# Altium project PMR_for_R124_test.PrjPcb (part 1 of 2)
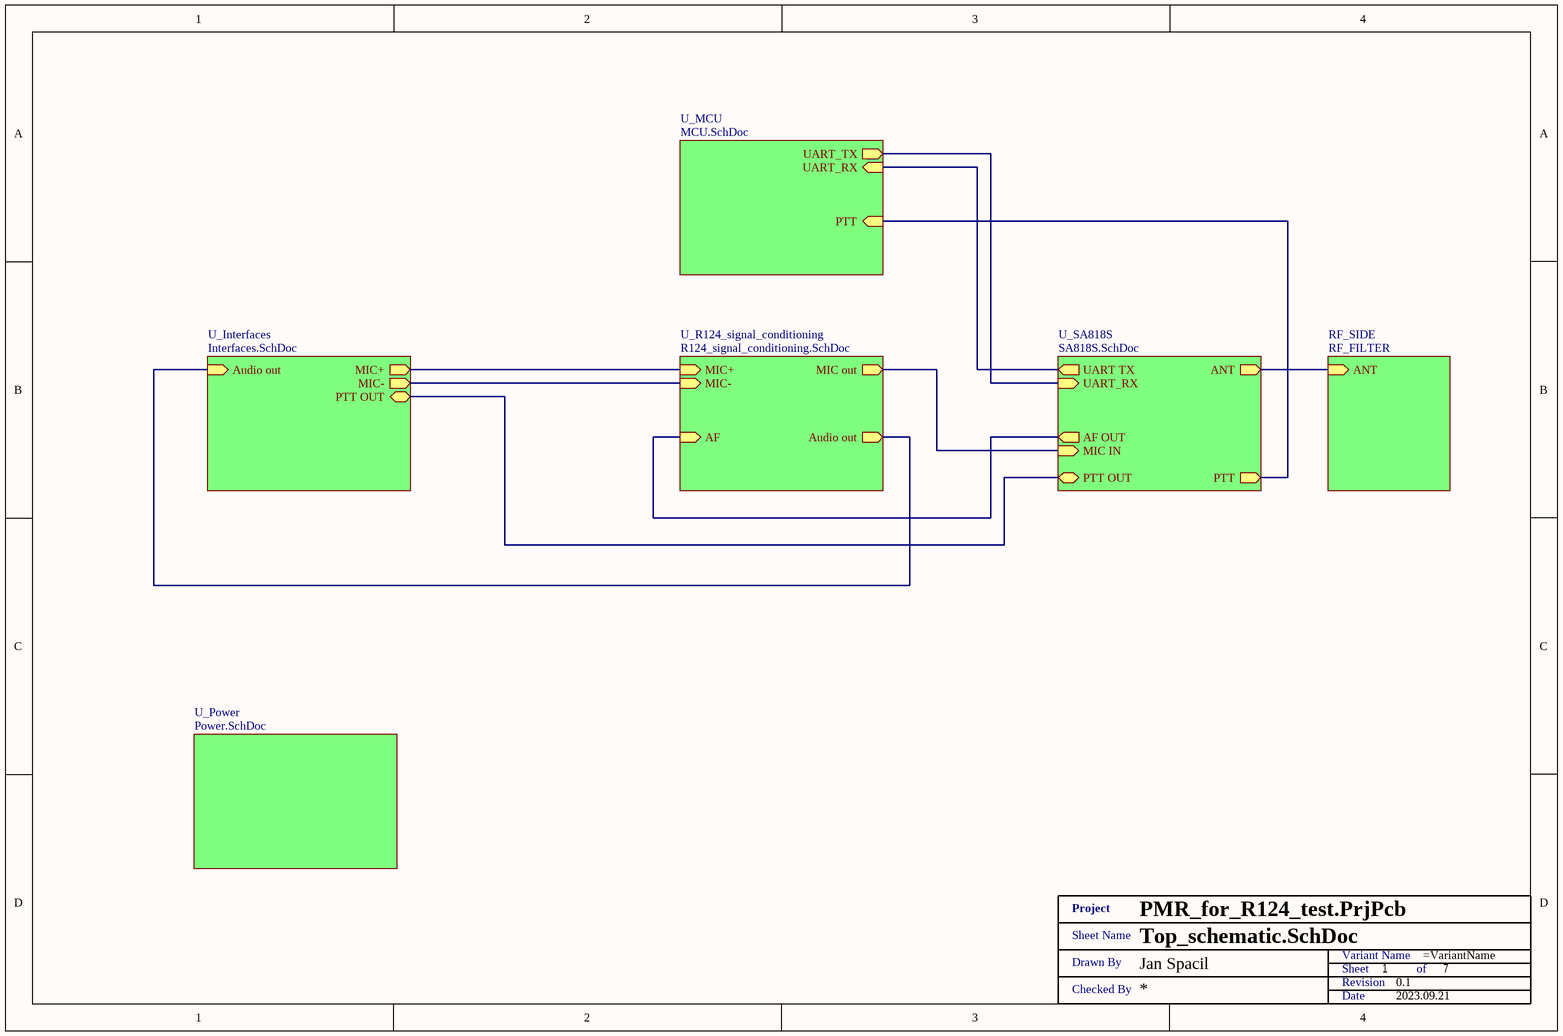
[diagram p0: Top_schematic.SchDoc]
Date: 2023.09.21; DrawnBy: Jan Spacil; Revision: 0.1
5 sheets, 116 parts. Net scope: hierarchical (ports join the sheet entries above them; power ports are global).
Board file: PMR_for_R124_test.PcbDoc
Sheets:
  Top_schematic.SchDoc
    U_R124_signal_conditioning = R124_signal_conditioning.SchDoc
    U_SA818S = SA818S.SchDoc
    U_MCU = MCU.SchDoc
    U_Interfaces = Interfaces.SchDoc

## Sheet Top_schematic.SchDoc
size A4; DocumentNumber: 1; SheetNumber: 1; SheetTotal: 7

### Parts
(Parts that share a designator on the sheet are numbered #1, #2 ... from top to bottom, then left to right.)
XX?#1  Title 1  (value not drawn)  (graphical)

### Sub-sheets
RF_SIDE = RF_FILTER (file not in this document): ANT (in)
U_Interfaces = Interfaces.SchDoc: MIC+ (out), MIC- (out), Audio out (in), PTT OUT (bidir)
U_MCU = MCU.SchDoc: UART_TX (out), UART_RX (in), PTT (in)
U_Power = Power.SchDoc (file not in this document): no entries
U_R124_signal_conditioning = R124_signal_conditioning.SchDoc: MIC+ (in), MIC- (in), MIC out (out), AF (in), Audio out (out)
U_SA818S = SA818S.SchDoc: ANT (out), UART_RX (in), UART TX (out), AF OUT (out), MIC IN (in), PTT OUT (bidir), PTT (out)

### Nets
AF OUT: sheet U_R124_signal_conditioning/AF, sheet U_SA818S/AF OUT
ANT: sheet U_SA818S/ANT, sheet RF_SIDE/ANT
AUDIO OUT: sheet U_R124_signal_conditioning/Audio out, sheet U_Interfaces/Audio out
MIC OUT: sheet U_R124_signal_conditioning/MIC out, sheet U_SA818S/MIC IN
MIC+: sheet U_R124_signal_conditioning/MIC+, sheet U_Interfaces/MIC+
MIC-: sheet U_R124_signal_conditioning/MIC-, sheet U_Interfaces/MIC-
PTT: sheet U_SA818S/PTT, sheet U_MCU/PTT
PTT OUT: sheet U_SA818S/PTT OUT, sheet U_Interfaces/PTT OUT
UART_RX: sheet U_SA818S/UART TX, sheet U_MCU/UART_RX
UART_TX: sheet U_SA818S/UART_RX, sheet U_MCU/UART_TX

### Notes on the sheet
- (in symbol Title 1) Project; Sheet Name; Variant Name; Drawn By; Sheet; of; Revision; Checked By; Date

## Sheet R124_signal_conditioning.SchDoc
size A3; DocumentNumber: 2; SheetNumber: 2; SheetTotal: 7
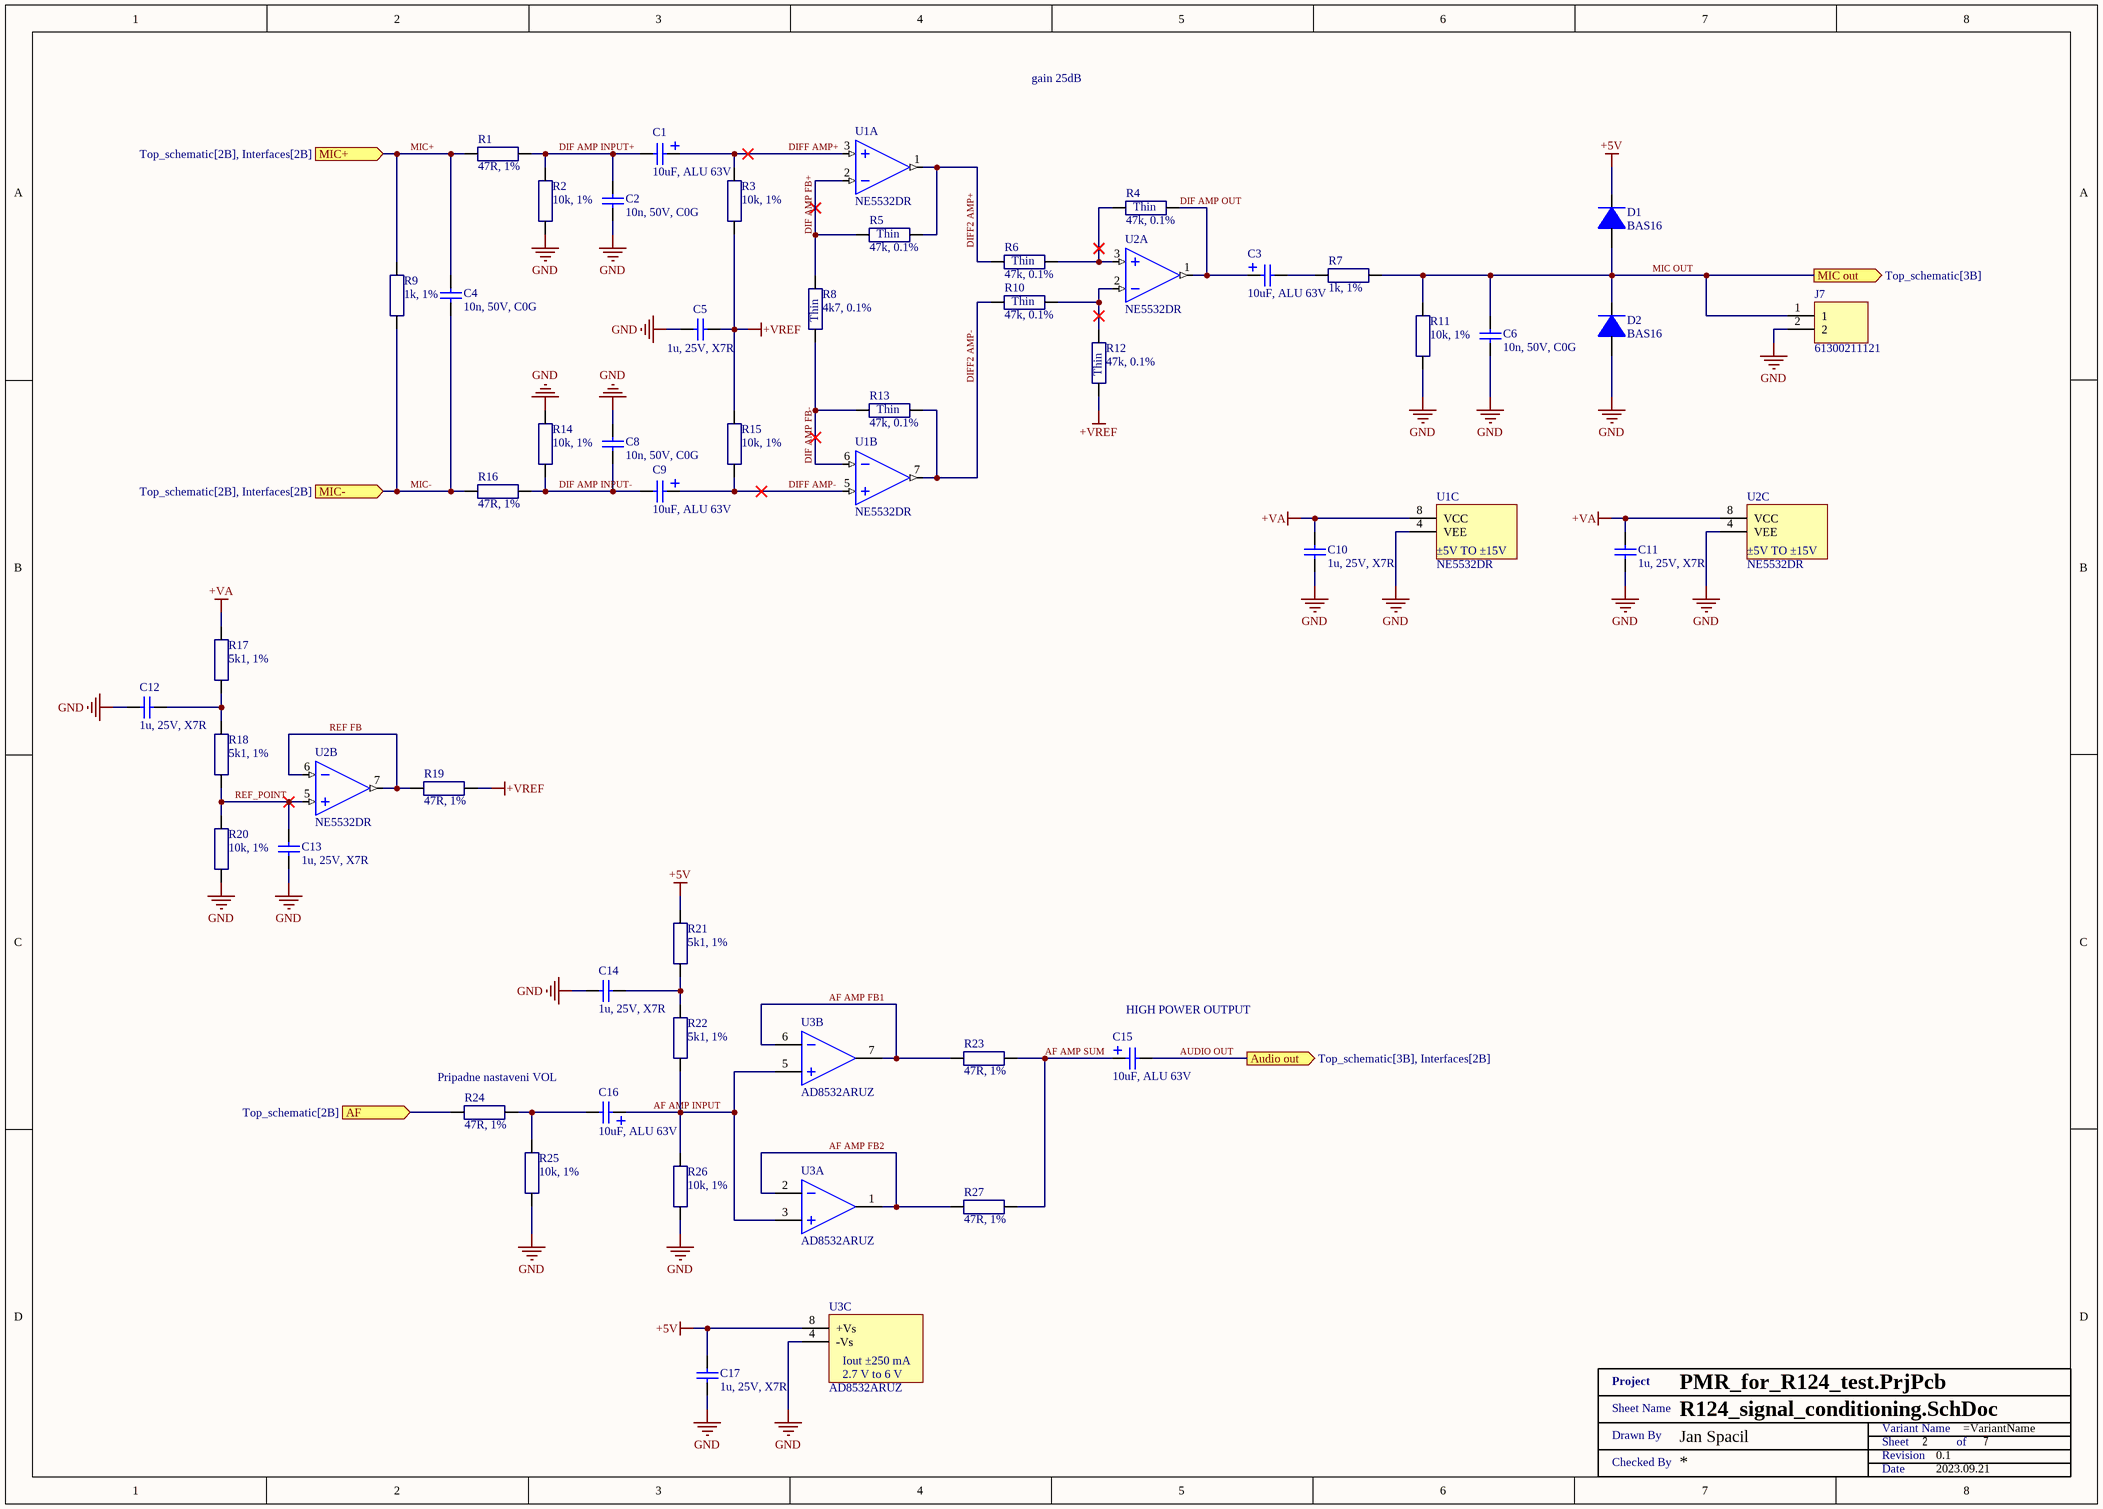
[diagram p1: R124_signal_conditioning.SchDoc]

### Parts
(Parts that share a designator on the sheet are numbered #1, #2 ... from top to bottom, then left to right.)
C1  10uF, ALU 63V  [WCAP-ATLI_5x11x2]
C2  10n, 50V, C0G  [SMD0603]
C3  10uF, ALU 63V  [WCAP-ATLI_5x11x2]
C4  10n, 50V, C0G  [SMD0603]
C5  1u, 25V, X7R  [SMD0603]
C6  10n, 50V, C0G  [SMD0603]
C8  10n, 50V, C0G  [SMD0603]
C9  10uF, ALU 63V  [WCAP-ATLI_5x11x2]
C10  1u, 25V, X7R  [SMD0603]
C11  1u, 25V, X7R  [SMD0603]
C12  1u, 25V, X7R  [SMD0603]
C13  1u, 25V, X7R  [SMD0603]
C14  1u, 25V, X7R  [SMD0603]
C15  10uF, ALU 63V  [WCAP-ATLI_5x11x2]
C16  10uF, ALU 63V  [WCAP-ATLI_5x11x2]
C17  1u, 25V, X7R  [SMD0603]
D1  BAS16  [SOT23 (TO-236AB)]
D2  BAS16  [SOT23 (TO-236AB)]
J7  61300211121  [Header 2 2.54mm]
R1  47R, 1%  [SMD0603 - R]
R2  10k, 1%  [SMD0603 - R]
R3  10k, 1%  [SMD0603 - R]
R4  47k, 0.1%  [SMD0603 - R]
R5  47k, 0.1%  [SMD0603 - R]
R6  47k, 0.1%  [SMD0603 - R]
R7  1k, 1%  [SMD0603 - R]
R8  4k7, 0.1%  [SMD0603 - R]
R9  1k, 1%  [SMD0603 - R]
R10  47k, 0.1%  [SMD0603 - R]
R11  10k, 1%  [SMD0603 - R]
R12  47k, 0.1%  [SMD0603 - R]
R13  47k, 0.1%  [SMD0603 - R]
R14  10k, 1%  [SMD0603 - R]
R15  10k, 1%  [SMD0603 - R]
R16  47R, 1%  [SMD0603 - R]
R17  5k1, 1%  [SMD0603 - R]
R18  5k1, 1%  [SMD0603 - R]
R19  47R, 1%  [SMD0603 - R]
R20  10k, 1%  [SMD0603 - R]
R21  5k1, 1%  [SMD0603 - R]
R22  5k1, 1%  [SMD0603 - R]
R23  47R, 1%  [SMD0603 - R]
R24  47R, 1%  [SMD0603 - R]
R25  10k, 1%  [SMD0603 - R]
R26  10k, 1%  [SMD0603 - R]
R27  47R, 1%  [SMD0603 - R]
U1  NE5532DR  [SOIC08]  (parts A,B,C of 3)
U2  NE5532DR  [SOIC08]  (parts A,B,C of 3)
U3  AD8532ARUZ  [TSSOP08]  (parts A,B,C of 3)
XX?#2  Title 1  (value not drawn)  (graphical)

### Ports
AF (in, see Top_schematic[2B]), Audio out (out, see Top_schematic[3B], Interfaces[2B]), MIC out (out, see Top_schematic[3B]), MIC+ (in, see Top_schematic[2B], Interfaces[2B]), MIC- (in, see Top_schematic[2B], Interfaces[2B])

### Nets
+5V: C17.2 D1.3(C) R21.2 U3.8(+Vs)
+VA: C10.2 C11.2 R17.2 U1.8(VCC) U2.8(VCC)
+VREF: C5.1 R3.1 R12.1 R15.1 R19.2
GND: C2.1 C5.2 C6.1 C8.2 C10.1 C11.1 C12.1 C13.1 C14.1 C17.1 D2.1(A) J7.2 R2.1 R11.1 R14.1 R20.2 R25.2 R26.2 U1.4(VEE) U2.4(VEE) U3.4(-Vs)
AF AMP FB1: R23.1 U3.6(-INb) U3.7(OUTb)
AF AMP FB2: R27.1 U3.1(OUTa) U3.2(-INa)
AF AMP INPUT: C16.1 R22.1 R26.1 U3.3(+INa) U3.5(+INb)
AF AMP SUM: C15.1 R23.2 R27.2
AF OUT: R24.1 ; port AF
AUDIO OUT: C15.2 ; port Audio out
DIF AMP FB+: R5.1 R8.2 U1.2(-IN_A)
DIF AMP FB-: R8.1 R13.1 U1.6(-IN_B)
DIF AMP INPUT+: C1.2 C2.2 R1.2 R2.2
DIF AMP INPUT-: C8.1 C9.2 R14.2 R16.2
DIF AMP OUT: C3.1 R4.2 U2.1(OUT_A)
DIFF2 AMP+: R5.2 R6.1 U1.1(OUT_A)
DIFF2 AMP-: R10.1 R13.2 U1.7(OUT_B)
DIFF AMP+: C1.1 R3.2 U1.3(+IN_A)
DIFF AMP-: C9.1 R15.2 U1.5(+IN_B)
MIC OUT: C6.2 D1.1(A) D2.3(C) J7.1 R7.1 R11.2 ; port MIC out
MIC+: C4.2 R1.1 R9.2 ; port MIC+
MIC-: C4.1 R9.1 R16.1 ; port MIC-
REF FB: R19.1 U2.6(-IN_B) U2.7(OUT_B)
REF_POINT: C13.2 R18.1 R20.1 U2.5(+IN_B)
NetC3_2: C3.2 R7.2
NetC12_2: C12.2 R17.1 R18.2
NetC14_2: C14.2 R21.1 R22.2
NetC16_2: C16.2 R24.2 R25.1
NetR4_1: R4.1 R6.2 U2.3(+IN_A)
NetR10_2: R10.2 R12.2 U2.2(-IN_A)

### Notes on the sheet
- gain 25dB
- (near C15) HIGH POWER OUTPUT
- Pripadne nastaveni VOL
- (in symbol AD8532ARUZ-REEL, part C) Iout ±250 mA; 2.7 V to 6 V
- (in symbol NE5532DR, part C) ±5V TO ±15V
- (in symbol RT0603BRB074K7L) Thin
- (in symbol RT0603BRD0747KL) Thin
- (in symbol Title 1) Project; Sheet Name; Variant Name; Drawn By; Sheet; of; Revision; Checked By; Date

### Library data of the parts
C1 C3 C9 C15 C16 = 860080772001: WURTH ELEKTRONIK - 860080772001 - CAP, ALU ELEC, 10UF, 63V, RADIAL; Ripple Current: 135mA @ 100kHz; Capacitance: 10u; Manufacturer: WURTH ELEKTRONIK; Manufacturer Part Number: 860080772001; RoHS: YES; Stock 1: 553; Pricing 1: 1=0.0957, 3=0.091, 5=0.0863, 10=0.0825, 20=0.0786, 50=0.0692, 250=0.0647, 500=0.0564 (GBP); ComponentLink1URL: http://www.farnell.com/datasheets/1879798.pdf; ComponentLink1Description: http://www.farnell.com/datasheets/1879798.pdf; Voltage Rating: 63V; Stock 3: 2136; Pricing 3: 1=0.62, 50=0.335, 100=0.289, 250=0.259, 500=0.235, 1500=0.202, 7500=0.182, 15000=0.178 (GBP); ComponentLink2URL: http://www.farnell.com/datasheets/2065186.pdf; ComponentLink2Description: http://www.farnell.com/datasheets/2065186.pdf; Supplier 1: Mouser; Supplier Part Number 1: 710-860080772001; Supplier 2: Farnell; Supplier Part Number 2: 2465955; Supplier 3: Digi-Key; Supplier Part Number 3: 732-9121-1-ND
C2 C4 C6 C8 = GRM1885C1H103JA01D: Multilayer Ceramic Capacitors MLCC - SMD/SMT 0603 50VDC 10000pF 5% C0G; Manufacturer: Murata Electronics; Type: Chip Multilayer Ceramic Capacitor for General Purpose; Capacitance - nF: 10 nF; Class: Class 1; CNHTS: 8532241000; Dielectric: C0G (NP0); TARIC: 8532240000; Supplier 1: Mouser; Supplier Part Number 1: 81-GRM1885C1H103JA1D; Manufacturer Part Number: GRM1885C1H103JA01D; RoHS: RoHS Compliant; Category: Multilayer Ceramic Capacitors MLCC - SMD/SMT; Stock 1: 217291; Pricing 1: 1=0.183, 10=0.129, 100=0.065, 500=0.045, 1000=0.039, 4000=0.030, 8000=0.027, 24000=0.025 (EUR); Capacitance: 10n; Height: 0.8 mm; Length: 1.6 mm; Package / Case: 0603 (1608 metric); Packaging: Cut Tape; Product: General Type MLCCs; Series: GRM; Termination Style: SMD/SMT; Tolerance: 5 %; Voltage Rating DC: 50 VDC; Width: 0.8 mm; Brand: Murata Electronics; Capacitance - pF: 10000 pF; Case Code - in: 0603; Case Code - mm: 1608; HTS Code: 8532240020; Maximum Operating Temperature: + 125 C; Minimum Operating Temperature: - 55 C; Product Type: Ceramic Capacitors; Standard Pack Qty: 4000; Subcategory: Capacitors; Termination: Standard; RoHS - Mouser: Y; Minimum Order Quantity: 1; Reeling: True; ComponentLink1URL: http://www.mouser.com/datasheet/2/281/murata_03052018_GRM_Series_1-1310166.pdf; ComponentLink1Description: http://www.mouser.com/datasheet/2/281/murata_03052018_GRM_Series_1-1310166.pdf; Supplier 2: Farnell; Supplier Part Number 2: 2456107
C5 C10-C14 C17 = CGA3E1X7R1E105K080AC: CAP CER 1UF 25V X7R 0603; Manufacturer: TDK Corporation; Tolerance: ±10%; Manufacturer Part Number: CGA3E1X7R1E105K080AC; RoHS: RoHS Compliant; Category: Capacitors; Stock 1: 109509; Pricing 1: 1=0.2, 10=0.135, 100=0.0686, 500=0.04696, 1000=0.04154 (USD); Packaging: Cut Tape (CT); Part Status: Active; Voltage - Rated: 25V; Temperature Coefficient: X7R; Operating Temperature: -55°C ~ 125°C; Features: -; Ratings: AEC-Q200; Applications: Automotive; Failure Rate: -; Mounting Type: Surface Mount, MLCC; Package / Case: 0603 (1608 Metric); Size / Dimension: 0.063" L x 0.032" W (1.60mm x 0.80mm); Height - Seated (Max): -; Thickness (Max): 0.035" (0.90mm); Lead Spacing: -; Lead Style: -; ComponentLink1URL: https://product.tdk.com/info/en/catalog/datasheets/mlcc_automotive_general_en.pdf; ComponentLink1Description: https://product.tdk.com/info/en/catalog/datasheets/mlcc_automotive_general_en.pdf; Capacitance: 1u; Supplier 1: Mouser; Supplier Part Number 1: 810-CGA3E1X7R1E105K; Supplier 2: Farnell; Supplier Part Number 2: 2346962; Supplier 3: Digi-Key; Supplier Part Number 3: 445-6931-1-ND
D1 D2 = BAS16: ON SEMICONDUCTOR/FAIRCHILD - BAS16 - DIODE, SWITCHING, 0.2A 85V, SOT-23; Diode Configuration: Single; Repetitive Reverse Voltage Vrrm Max: 85; Forward Current If(AV): 200; Forward Voltage VF Max: 1; Reverse Recovery Time trr Max: 6; No. of Pins: 3; Product Range: BAS16 Series; SVHC: No SVHC (15-Jun-2015); Current If @ Vf: 50; External Depth: 2.5; External Length / Height: 1.12; External Width: 3.05; Junction Temperature Tj Max: 150; Peak Forward Current: 600; Power Dissipation Ptot Max: 350; SMD Marking: A6; Test Current: 50mA<!--FANDB--><div class="features-and-benefits-container"><div class="features-and-benefits-desc-container"><span class="features-and-benefits-container-desc">Small Signal Diode, Single, 85 V, 200 mA, 1 V, 6 ns, 1 A</span></div><div class="features-and-benefits-description"><span class="features-benefits-value">The BAS16 is a high conductance ultra fast Small Signal Diode for general usage and suitable for many different applications.</span></div><div class="features-and-benefits-list"><ul class="features-and-benefits-list-list"><li class="features-and-benefits-list-item">-55 to 150; Supplier 1: Farnell; Supplier Part Number 1: 9843957; Manufacturer: ON SEMICONDUCTOR/FAIRCHILD; Manufacturer Part Number: BAS16; RoHS: YES; Stock 1: 114340; Pricing 1: 10=0.134, 100=0.0463, 1000=0.0273, 3000=0.0181 (GBP); Forward Surge Current Ifsm Max: 1; Operating Temperature Max: 150; Diode Case Style: SOT-23; Packaging: Cut Tape; Automotive Qualification Standard: -; Current Ifsm: 1; Forward Current If Max: 50; Forward Voltage: 1; MSL: MSL 1 - Unlimited; Operating Temperature Min: -55; Operating Temperature Range: -55°C to +150; ComponentLink1URL: http://www.farnell.com/datasheets/2283986.pdf; ComponentLink1Description: http://www.farnell.com/datasheets/2283986.pdf; ComponentLink2URL: http://www.farnell.com/datasheets/410597.pdf; ComponentLink2Description: http://www.farnell.com/datasheets/410597.pdf; ComponentLink3URL: http://www.farnell.com/datasheets/2040241.pdf; ComponentLink3Description: http://www.farnell.com/datasheets/2040241.pdf
J7 = 61300211121: CONN HEADER 2 POS 2.54; Manufacturer: Wurth Electronics Inc.; Pitch - Mating: 0.100" (2.54mm); Number of Positions: 2; Number of Positions Loaded: All; Style: Board to Board or Cable; Shrouding: Unshrouded; Contact Length - Mating: 0.236" (6.00mm); Contact Length - Post: 0.118" (3.00mm); Overall Contact Length: 0.454" (11.54mm); Material Flammability Rating: UL94 V-0; Current Rating: 3A; Voltage Rating: 250V; Manufacturer Part Number: 61300211121; RoHS: RoHS Compliant; Category: Connectors, Interconnects; Stock 1: 164911; Pricing 1: 1=0.13, 10=0.106, 25=0.088, 50=0.074, 100=0.067, 1000=0.061 (USD); Packaging: Bulk; Part Status: Active; Connector Type: Header; Contact Type: Male Pin; Number of Rows: 1; Row Spacing - Mating: -; Mounting Type: Through Hole; Termination: Solder; Fastening Type: Push-Pull; Insulation Height: 0.100" (2.54mm); Contact Shape: Square; Contact Finish - Mating: Gold; Contact Finish Thickness - Mating: -; Contact Finish - Post: -; Contact Material: Copper Alloy; Insulation Material: Polybutylene Terephthalate (PBT); Features: -; Operating Temperature: -40°C ~ 125°C; Ingress Protection: -; Insulation Color: Black; Mated Stacking Heights: -; Contact Finish Thickness - Post: -; Applications: -; ComponentLink1URL: https://katalog.we-online.de/em/datasheet/6130xx11121.pdf; ComponentLink1Description: https://katalog.we-online.de/em/datasheet/6130xx11121.pdf; Supplier 1: Mouser; Supplier Part Number 1: 710-61300211121; Supplier 2: Farnell; Supplier Part Number 2: 2356153; Supplier 3: Digi-Key; Supplier Part Number 3: 732-5315-ND
R1 R16 R19 R23 R24 R27 = RC0603FR-0747RL: YAGEO - RC0603FR-0747RL - Surface Mount Chip Resistor, Thick Film, RC Series, 47 ohm, 100 mW, 1%, 50 V, 0603 [1608 Metric] RoHS Compliant: Yes; Power Rating: 100mW; Voltage Rating (DC): 50V; Temperature Coefficient: 100ppm/°C; Voltage Rating: 75V; Supplier 1: Mouser; Supplier Part Number 1: 603-RC0603FR-0747RL; Manufacturer: Yageo; Manufacturer Part Number: RC0603FR-0747RL; RoHS: Yes; Category: Chip SMD Resistors; Stock 1: 314282; Pricing 1: 1=0.10000, 10=0.01800, 100=0.00600, 1000=0.00500, 5000=0.00300, 10000=0.00300 (USD); Case/Package: 0603; Number of Pins: 2; Weight: 7.1E-05oz; Case Code (Imperial): 0603; Case Code (Metric): 1608; Min Operating Temperature: -55°C; Max Operating Temperature: 155°C; Resistance: 47R; Tolerance: 1%; Packaging: Tape and Reel; Package Quantity: 1; Termination: SMD/SMT; Resistor Type: Thick Film; Number of Terminations: 2; Max Power Dissipation: 100mW; Features: Moisture Resistant; Length: 1.6mm; Height: 0.45mm; Width: 0.8mm; Depth: 0.8mm; REACH SVHC: Unknown; Lead Free: Lead Free; Military Standard: Not; ComponentLink1URL: https://datasheet.ciiva.com/2453/pyu-r-int-thick-7-2453922.pdf?src-supplier=Digi-Key; ComponentLink1Description: https://datasheet.ciiva.com/2453/pyu-r-int-thick-7-2453922.pdf?src-supplier=Digi-Key; ComponentLink2URL: https://datasheet.ciiva.com/2453/pyu-r-int-thick-7-2453923.pdf?src-supplier=Digi-Key; ComponentLink2Description: https://datasheet.ciiva.com/2453/pyu-r-int-thick-7-2453923.pdf?src-supplier=Digi-Key; ComponentLink3URL: https://datasheet.ciiva.com/2453/pyu-r-int-thick-7-2453924.pdf?src-supplier=Digi-Key; ComponentLink3Description: https://datasheet.ciiva.com/2453/pyu-r-int-thick-7-2453924.pdf?src-supplier=Digi-Key; ComponentLink4URL: https://datasheet.ciiva.com/7746/443971-7746363.pdf?src-supplier=Element14; ComponentLink4Description: https://datasheet.ciiva.com/7746/443971-7746363.pdf?src-supplier=Element14; ComponentLink5URL: https://datasheet.ciiva.com/7746/443971-7746364.pdf?src-supplier=Element14; ComponentLink5Description: https://datasheet.ciiva.com/7746/443971-7746364.pdf?src-supplier=Element14; ComponentLink6URL: https://datasheet.ciiva.com/46440/1868787-46440908.pdf?src-supplier=Element14; ComponentLink6Description: https://datasheet.ciiva.com/46440/1868787-46440908.pdf?src-supplier=Element14; Supplier 2: Farnell; Supplier Part Number 2: 9238328; Supplier 3: Digi-Key; Supplier Part Number 3: 311-47.0HRCT-ND
R2 R3 R11 R14 R15 R20 R25 R26 = RC0603FR-0710KL: YAGEO (PHYCOMP) - RC0603FR-0710KL - RES, THICK FILM, 10K, 1%, 0.1W, 0603; Voltage Rating: 50; Resistor Case Style: 0603 [1608 Metric]; Power Rating: 100; Product Range: RC Series; Temperature Coefficient: ± 100; SVHC: No SVHC (20-Jun-2016); Manufacturer: YAGEO (PHYCOMP); Manufacturer Part Number: RC0603FR-0710KL; RoHS: YES; Stock 1: 9995; Pricing 1: 5000=0.0025, 25000=0.0014, 50000=0.0013 (GBP); Resistance: 10k; Resistance Tolerance: ± 1%; Packaging: Tape & Reel; Resistor Element Material: Thick Film; Automotive Qualification Standard: -; MSL: MSL 1 - Unlimited<!--FANDB--><div class="features-and-benefits-container"><div class="features-and-benefits-desc-container"><span class="features-and-benefits-container-desc">SMD Chip Resistor, Thick Film, 10 kohm, 50 V, 0603 [1608 Metric], 100 mW, ± 1; ComponentLink1URL: http://past.yageo.com/pdf/PYu-R_Packing_6.pdf; ComponentLink1Description: http://past.yageo.com/pdf/PYu-R_Packing_6.pdf; ComponentLink2URL: http://www.farnell.com/datasheets/2167052.pdf; ComponentLink2Description: http://www.farnell.com/datasheets/2167052.pdf; Supplier 1: Mouser; Supplier Part Number 1: 603-RC0603FR-0710KL; Supplier 2: Farnell; Supplier Part Number 2: 2421850; Supplier 3: Digi-Key; Supplier Part Number 3: 311-10.0KHRCT-ND
R4-R6 R10 R12 R13 = RT0603BRD0747KL: RES SMD 47K OHM 0.1% 1/10W 0603; Manufacturer: Yageo; Voltage Rating: 75V; Resistance: 47kR; Power Rating: 100mW; Temperature Coefficient: 25ppm/°C; Voltage Rating (DC): 50V; Supplier 1: Mouser; Supplier Part Number 1: 603-RT0603BRD0747KL; Manufacturer Part Number: RT0603BRD0747KL; RoHS: Yes; Category: Chip SMD Resistors; Stock 1: 4858; Pricing 1: 1=0.38000, 10=0.23400, 50=0.23400, 100=0.07600, 1000=0.05300, 10000=0.03800 (USD); Case/Package: 0603; Case Code (Metric): 1608; Case Code (Imperial): 0603; Contact Plating: Tin,Lead; Min Operating Temperature: -55°C; Max Operating Temperature: 125°C; Packaging: Tape and Reel; Package Quantity: 5000; Resistor Type: Thin Film; Termination: SMD/SMT; Number of Terminations: 2; Max Power Dissipation: 100mW; Features: Moisture Resistant; Series: RT; Construction: Rectangular; Length: 0.063inch; Width: 0.031inch; Height: 0.022inch; Depth: 0.8mm; Military Standard: Not; Lead Free: Lead Free; RoHS Compliant: Yes; ComponentLink1URL: https://datasheet.ciiva.com/2585/pyu-rt-1-to-0-05-rohs-l-4-2585964.pdf?src-supplier=Digi-Key; ComponentLink1Description: https://datasheet.ciiva.com/2585/pyu-rt-1-to-0-05-rohs-l-4-2585964.pdf?src-supplier=Digi-Key; ComponentLink2URL: https://datasheet.ciiva.com/46635/pyu-rt-1-to-0-05-rohs-l-5-46635309.pdf?src-supplier=Digi-Key; ComponentLink2Description: https://datasheet.ciiva.com/46635/pyu-rt-1-to-0-05-rohs-l-5-46635309.pdf?src-supplier=Digi-Key; Supplier 2: Digi-Key; Supplier Part Number 2: YAG1667CT-ND; Supplier 3: Arrow Electronics; Supplier Part Number 3: RT0603BRD0747KL
R7 R9 = MCWR06X1001FTL: MULTICOMP - MCWR06X1001FTL - RES, THICK FILM, 1K, 1%, 0.1W, 0603; Voltage Rating: 50; Resistor Case Style: 0603 [1608 Metric]; Power Rating: 100; Product Range: MCWR Series; Temperature Coefficient: ± 100; SVHC: No SVHC (07-Jul-2017)<!--FANDB--><div class="features-and-benefits-container"><div class="features-and-benefits-desc-container"><span class="features-and-benefits-container-desc">SMD Chip Resistor, Thick Film, 1 kohm, 50 V, 0603 [1608 Metric], 100 mW, ± 1; Manufacturer: MULTICOMP; Manufacturer Part Number: MCWR06X1001FTL; RoHS: Y-EX; Stock 1: 134740; Pricing 1: 10=0.0037, 100=0.0022, 500=0.0016, 1000=0.0012, 2500=0.001 (GBP); Resistance: 1k; Resistance Tolerance: ± 1%; Packaging: Cut Tape; Resistor Element Material: Thick Film; Automotive Qualification Standard: -; ComponentLink1URL: http://www.farnell.com/datasheets/1849611.pdf; ComponentLink1Description: http://www.farnell.com/datasheets/1849611.pdf; Supplier 1: Farnell; Supplier Part Number 1: 2447272; Supplier 2: Newark; Supplier Part Number 2: 94X1378
R8 = RT0603BRB074K7L: Res Thin Film 0603 4.7K Ohm 0.1% 0.1W(1/10W) ±10ppm/C Molded SMD Paper T/R; Manufacturer: Yageo; Voltage Rating: 75V; Resistance: 4.7kR; Power Rating: 100mW; Temperature Coefficient: 10ppm/°C; Supplier 1: Mouser; Supplier Part Number 1: 603-RT0603BRB074K7L; Manufacturer Part Number: RT0603BRB074K7L; RoHS: Yes; Category: Chip SMD Resistors; Stock 1: 3590; Pricing 1: 1=0.58000, 10=0.41700, 50=0.41700, 100=0.23600, 1000=0.19100, 10000=0.15800 (USD); Case/Package: 0603; Case Code (Metric): 1608; Case Code (Imperial): 0603; Min Operating Temperature: -55°C; Max Operating Temperature: 125°C; Tolerance: 0.1%; Packaging: Tape and Reel; Resistor Type: Thin Film; Number of Terminations: 2; Termination: SMD/SMT; Max Power Dissipation: 100mW; Features: Moisture Resistant; Series: RT; Construction: Rectangular; Length: 0.063inch; Width: 0.031inch; Height: 0.022inch; Depth: 0.8mm; Military Standard: Not; RoHS Compliant: Yes; ComponentLink1URL: https://datasheet.ciiva.com/12721/pyu-rt-1-to-0-05-rohs-l-4-12721239.pdf?src-supplier=Mouser; ComponentLink1Description: https://datasheet.ciiva.com/12721/pyu-rt-1-to-0-05-rohs-l-4-12721239.pdf?src-supplier=Mouser; Supplier 2: Digi-Key; Supplier Part Number 2: YAG4447CT-ND
R17 R18 R21 R22 = RC0603FR-075K1L: RES SMD 5.1K OHM 1% 1/10W 0603; Manufacturer: Yageo; Power Rating: 100mW; Temperature Coefficient: 100ppm/°C; Voltage Rating: 50V; Supplier 1: Mouser; Supplier Part Number 1: 603-RC0603FR-075K1L; Manufacturer Part Number: RC0603FR-075K1L; RoHS: Yes; Category: Chip SMD Resistors; Stock 1: 489882; Pricing 1: 1=0,10000, 10=0,01800, 50=0,01800, 100=0,00600, 1000=0,00500, 10000=0,00300 (USD); Case/Package: 0603; Number of Pins: 2; Case Code (Imperial): 0603; Case Code (Metric): 1608; Size Code: 0603; Min Operating Temperature: -55°C; Max Operating Temperature: 155°C; Tolerance: 1%; Series: RC; Resistance: 5k1; Packaging: Tape and Reel; Package Quantity: 1; Termination: SMD/SMT; Resistor Type: Thick Film; Number of Terminations: 2; Max Power Dissipation: 100mW; Voltage Rating (DC): 50V; Features: Moisture Resistant; Resistance Tolerance: 1%; Construction: Rectangular; Length: 0.063inch; Width: 0.031inch; Height: 0.022inch; Depth: 0.8mm; RoHS Compliant: Yes; REACH SVHC: No SVHC; Military Standard: Not; Lead Free: Lead Free; ComponentLink1URL: https://datasheet.ciiva.com/46395/443971-46395016.pdf?src-supplier=Element14; ComponentLink1Description: https://datasheet.ciiva.com/46395/443971-46395016.pdf?src-supplier=Element14; ComponentLink2URL: https://datasheet.ciiva.com/15189/getdatasheetpartid-326732-15189786.pdf?src-supplier=Verical; ComponentLink2Description: https://datasheet.ciiva.com/15189/getdatasheetpartid-326732-15189786.pdf?src-supplier=Verical; ComponentLink3URL: https://datasheet.ciiva.com/2454/pyu-r-int-thick-7-2454045.pdf?src-supplier=Digi-Key; ComponentLink3Description: https://datasheet.ciiva.com/2454/pyu-r-int-thick-7-2454045.pdf?src-supplier=Digi-Key; ComponentLink4URL: https://datasheet.ciiva.com/2454/pyu-r-int-thick-7-2454046.pdf?src-supplier=Digi-Key; ComponentLink4Description: https://datasheet.ciiva.com/2454/pyu-r-int-thick-7-2454046.pdf?src-supplier=Digi-Key; ComponentLink5URL: https://datasheet.ciiva.com/2454/pyu-r-int-thick-7-2454047.pdf?src-supplier=Digi-Key; ComponentLink5Description: https://datasheet.ciiva.com/2454/pyu-r-int-thick-7-2454047.pdf?src-supplier=Digi-Key; Supplier 2: Farnell; Supplier Part Number 2: 3495881; Supplier 3: Digi-Key; Supplier Part Number 3: 311-5.10KHRCT-ND
U1 U2 = NE5532DR: 2-channel, 10-MHz, 26-V output swing, low-noise audio op amp 8-SOIC 0 to 70; Manufacturer: Texas Instruments; Bandwidth: 10MHz; Number of Channels: 2; Voltage Gain: 100dB; Min Dual Supply Voltage: 5V; Max Dual Supply Voltage: 15V; Output Current: 38mA; Nominal Supply Current: 16mA; Common Mode Rejection Ratio: 70dB; Slew Rate: 9V/µs; Max I/O Voltage: 4mV; Input Bias Current: 800nA; Operating Supply Current: 8mA; Dual Supply Voltage: 9V; Parameter 1: Jellybean; Supplier 1: Mouser; Supplier Part Number 1: 595-NE5532DR; Manufacturer Part Number: NE5532DR; RoHS: Yes; Category: Amplifiers - Op Amps, Buffer, Instrumentation; Pricing 1: 1=0.60000, 10=0.51400, 50=0.51400, 100=0.35600, 500=0.30100, 1000=0.23300, 2500=0.21100, 10000=0.21100 (USD); Case/Package: D; Number of Pins: 8; Contact Plating: Gold; Min Operating Temperature: 0°C; Max Operating Temperature: 70°C; Packaging: Tape and Reel; Number of Circuits: 2; Gain Bandwidth Product: 10MHz; Unity Gain Bandwidth Product: 10MHz; Package Quantity: 1; Nominal Gain Bandwidth Product: 10MHz; Input Offset Voltage (Vos): 4mV; Output Current per Channel: 38mA; Number of Elements: 2; Max Supply Voltage: 15V; Number of Amplifiers: 2; Length: 4.9mm; Width: 3.91mm; Height: 1.58mm; Radiation Hardening: No; Lead Free: Lead Free; RoHS Compliant: Yes; REACH SVHC: No SVHC; ComponentLink1URL: https://datasheet.ciiva.com/1796/ne5532-1796190.pdf?src-supplier=Digi-Key; ComponentLink1Description: https://datasheet.ciiva.com/1796/ne5532-1796190.pdf?src-supplier=Digi-Key; ComponentLink2URL: https://datasheet.ciiva.com/1796/ne5532-1796189.pdf?src-supplier=Digi-Key; ComponentLink2Description: https://datasheet.ciiva.com/1796/ne5532-1796189.pdf?src-supplier=Digi-Key; ComponentLink3URL: https://datasheet.ciiva.com/1796/ne5532-1796191.pdf?src-supplier=Digi-Key; ComponentLink3Description: https://datasheet.ciiva.com/1796/ne5532-1796191.pdf?src-supplier=Digi-Key; Supplier 2: Farnell; Supplier Part Number 2: 3117312; Supplier 3: Digi-Key; Supplier Part Number 3: 296-13622-6-ND
U3 = AD8532ARUZ-REEL: Low Cost, 250 mA Output, Single-Supply Amplifiers, DUAL, CMOS, TSSOP, 8PIN, PLASTIC; Manufacturer: Analog Devices; Min Supply Voltage: 2.7V; Max Supply Voltage: 6V; Voltage Gain: 98.06dB; Unity Gain Bandwidth Product: 3MHz; Common Mode Rejection Ratio: 47dB; Slew Rate: 5V/µs; Number of Circuits: 2; Input Bias Current: 5pA; Input Offset Voltage (Vos): 25mV; Operating Supply Current: 2.5mA; Output Current per Channel: 250mA; Input Voltage Noise Density: 45nV/sqrt Hz; Power Supply Rejection Ratio (PSRR): 55dB; Quiescent Current: 1.25mA; Settling Time: 1.4us; Amplifier Type: GENERAL PURPOSE; Supplier 1: Mouser; Supplier Part Number 1: 584-AD8532ARUZ-R; Manufacturer Part Number: AD8532ARUZ-REEL; RoHS: Yes; Category: Amplifiers - Op Amps, Buffer, Instrumentation; Stock 1: 16323; Pricing 1: 1=1.55, 10=1.32, 50=1.32, 100=1.12, 1000=0.762, 10000=0.648 (USD); Case/Package: TSSOP; Pins: 8; Contact Plating: Tin,Matte; Min Operating Temperature: -40°C; Max Operating Temperature: 85°C; Packaging: Tape and Reel; Package Quantity: 2500; Gain Bandwidth Product: 3MHz; Number of Channels: 2; Number of Elements: 2; Number of Amplifiers: 2; Series: -; Technology: CMOS; Lead Free: Contains Lead; RoHS Compliant: Yes; ComponentLink1URL: https://datasheet.ciiva.com/45425/ad8531-8532-8534-45425830.pdf?src-supplier=Digi-Key; ComponentLink1Description: https://datasheet.ciiva.com/45425/ad8531-8532-8534-45425830.pdf?src-supplier=Digi-Key; Supplier 2: Farnell; Supplier Part Number 2: 4019791RL; Supplier 3: Digi-Key; Supplier Part Number 3: 505-AD8532ARUZ-REELCT-ND

## Sheet SA818S.SchDoc
size A4; DocumentNumber: 3; SheetNumber: 3; SheetTotal: 7
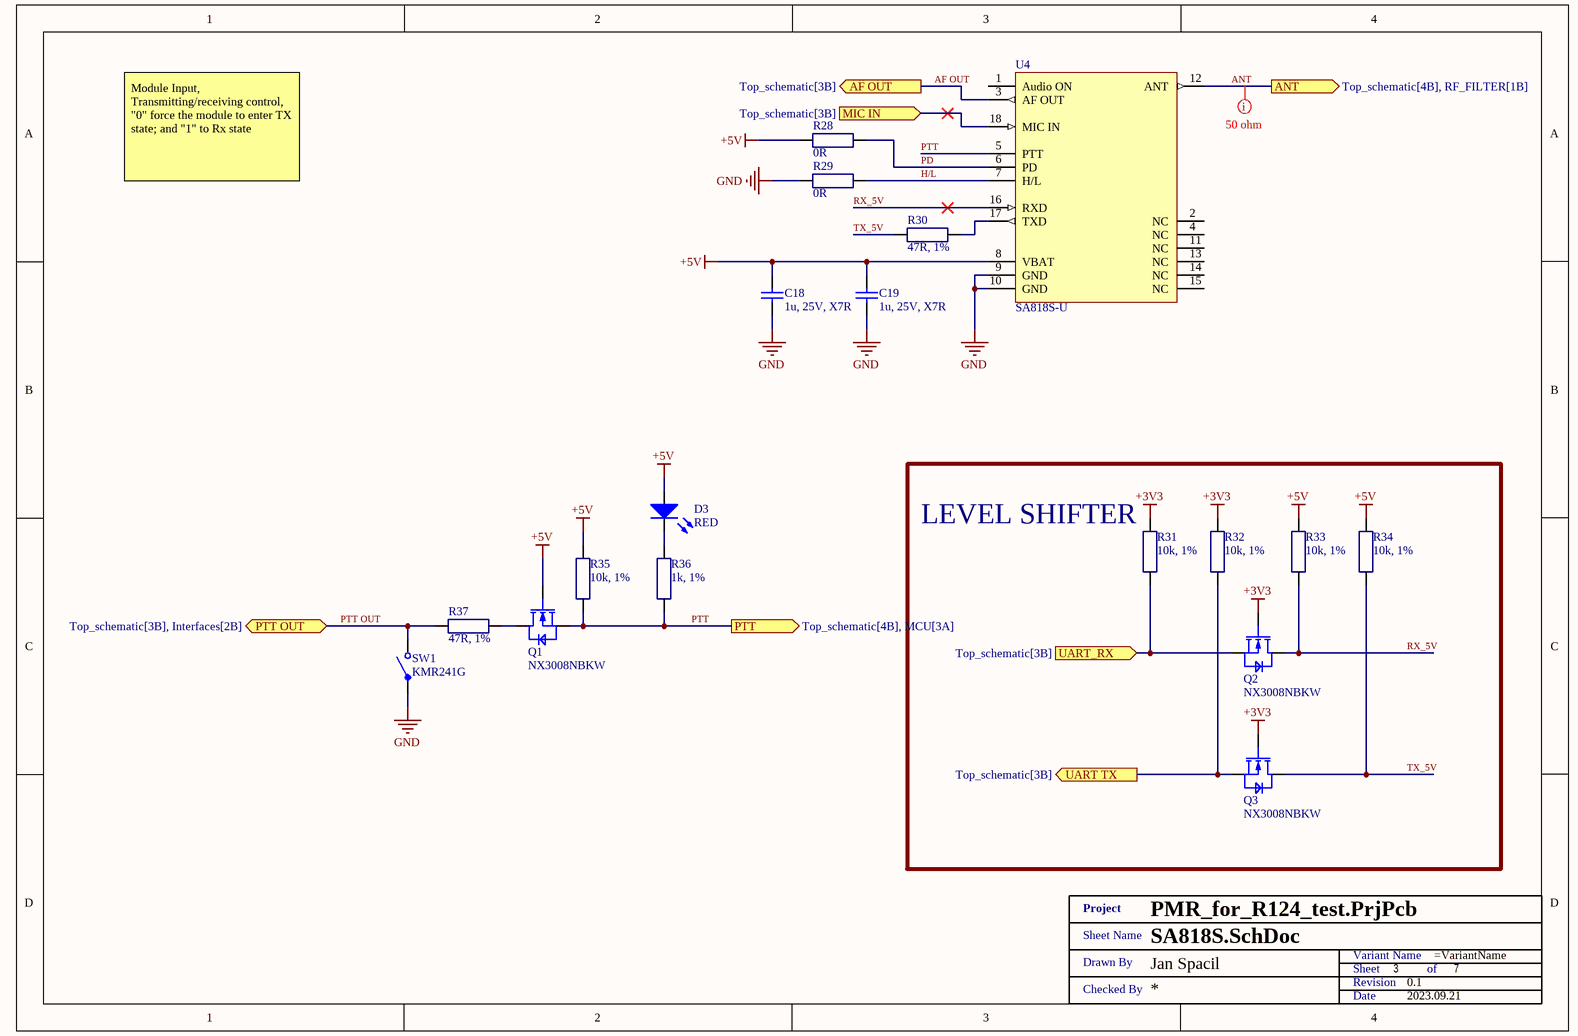
[diagram p2: SA818S.SchDoc]

### Parts
(Parts that share a designator on the sheet are numbered #1, #2 ... from top to bottom, then left to right.)
C18  1u, 25V, X7R  [SMD0603]
C19  1u, 25V, X7R  [SMD0603]
D3  RED  [MCL-S270]
Q1  NX3008NBKW  [SOT323]
Q2  NX3008NBKW  [SOT323]
Q3  NX3008NBKW  [SOT323]
R28  0R  [SMD0603 - R]
R29  0R  [SMD0603 - R]
R30  47R, 1%  [SMD0603 - R]
R31  10k, 1%  [SMD0603 - R]
R32  10k, 1%  [SMD0603 - R]
R33  10k, 1%  [SMD0603 - R]
R34  10k, 1%  [SMD0603 - R]
R35  10k, 1%  [SMD0603 - R]
R36  1k, 1%  [SMD0603 - R]
R37  47R, 1%  [SMD0603 - R]
SW1  KMR241G  [KMR2]
U4  SA818S-U  [SA818S]
XX?#3  Title 1  (value not drawn)  (graphical)

### Blocks framed on the sheet
LEVEL SHIFTER: Q2 Q3 R31-R34

### Ports
AF OUT (out, see Top_schematic[3B]), ANT (out, see Top_schematic[4B], RF_FILTER[1B]), MIC IN (in, see Top_schematic[3B]), PTT (out, see Top_schematic[4B], MCU[3A]), PTT OUT (bidir, see Top_schematic[3B], Interfaces[2B]), UART TX (out, see Top_schematic[3B]), UART_RX (in, see Top_schematic[3B])

### Nets
+3V3: Q2.1(G) Q3.1(G) R31.1 R32.1
+5V: C18.2 C19.2 D3.2(A) Q1.1(G) R28.1 R33.1 R34.1 R35.1 U4.8(VBAT)
GND: C18.1 C19.1 R29.1 SW1.1 U4.9(GND) U4.10(GND)
AF OUT: U4.3(AF_OUT) ; port AF OUT
ANT: U4.12(ANT) ; port ANT
H/L: R29.2 U4.7(H/L)
MIC OUT: U4.18(MIC_IN) ; port MIC IN
PD: R28.2 U4.6(PD)
PTT: Q1.2(S) R35.2 R36.1 U4.5(PTT) ; port PTT
PTT OUT: R37.2 SW1.2 ; port PTT OUT
RX_5V: Q2.3(D) R33.2 U4.16(RXD)
TX_5V: Q3.3(D) R30.1 R34.2
UART_RX: Q3.2(S) R32.2 ; port UART TX
UART_TX: Q2.2(S) R31.2 ; port UART_RX
NetD3_1: D3.1(K) R36.2
NetQ1_3: Q1.3(D) R37.1
NetR30_2: R30.2 U4.17(TXD)

Not connected (* = marked no-connect by the designer): U4 1(Audio_ON) 2(NC) 4(NC) 11(NC) 13(NC) 14(NC) 15(NC)

### Layout directives
net class 50 ohm: ANT

### Notes on the sheet
- Module Input, Transmitting/receiving control, "0" force the module to enter TX state; and "1" to Rx state
- (in symbol Title 1) Project; Sheet Name; Variant Name; Drawn By; Sheet; of; Revision; Checked By; Date

### Library data of the parts
C18 C19 = CGA3E1X7R1E105K080AC: as C5 on sheet R124_signal_conditioning; Manufacturer Part Number: CGA3E1X7R1E105K080AC; RoHS: RoHS Compliant; Category: Capacitors; Stock 1: 109509; Pricing 1: 1=0.2, 10=0.135, 100=0.0686, 500=0.04696, 1000=0.04154 (USD); Packaging: Cut Tape (CT); Part Status: Active; Voltage - Rated: 25V; Temperature Coefficient: X7R; Operating Temperature: -55°C ~ 125°C; Features: -; Ratings: AEC-Q200; Applications: Automotive; Failure Rate: -; Mounting Type: Surface Mount, MLCC; Package / Case: 0603 (1608 Metric); Size / Dimension: 0.063" L x 0.032" W (1.60mm x 0.80mm); Height - Seated (Max): -; Thickness (Max): 0.035" (0.90mm); Lead Spacing: -; Lead Style: -; ComponentLink1URL: https://product.tdk.com/info/en/catalog/datasheets/mlcc_automotive_general_en.pdf; ComponentLink1Description: https://product.tdk.com/info/en/catalog/datasheets/mlcc_automotive_general_en.pdf; Capacitance: 1u; Supplier 1: Mouser; Supplier Part Number 1: 810-CGA3E1X7R1E105K; Supplier 2: Farnell; Supplier Part Number 2: 2346962; Supplier 3: Digi-Key; Supplier Part Number 3: 445-6931-1-ND
D3 = MCL-S270SRC: MULTICOMP - MCL-S270SRC - LED, SMD, 0805, SUPER-RED; Bulb Size: 1.25mm x 1.4; Forward Current If: 20; Forward Voltage: 1.85; Wavelength Typ: 643; Luminous Intensity: 17; Viewing Angle: 140°; Lens Shape: Rectangular; SVHC: No SVHC (17-Dec-2015); Forward Voltage VF Max: 2.4; LED / Lamp Size: 1.4mm x 1.25; LED Type: Standard; Luminous Intensity Min: 14; No. of Pins: 2; Peak Forward Current: 120; Peak Wavelength: 660; Power Dissipation Pd: 100; Reverse Protection Voltage: 5; Voltage Vf Min: 1.5; Voltage Vf Typ: 1.85V<!--FANDB--><div class="features-and-benefits-container"><div class="features-and-benefits-description"><span class="features-benefits-value">The MCL-S270SRC is a super red SMD LED with water clear epoxy, made of GaAlAs dice.</span></div><div class="features-and-benefits-list"><ul class="features-and-benefits-list-list"><li class="features-and-benefits-list-item">0805 Case</li><li class="features-and-benefits-list-item">5V Reverse voltage</li><li class="features-and-benefits-list-item">10?A at 5V Reverse current</li><li class="features-and-benefits-list-item">-40 to 85; Manufacturer: MULTICOMP; Manufacturer Part Number: MCL-S270SRC; RoHS: YES; Stock 1: 27404; Pricing 1: 5=0,154, 25=0,142, 100=0,132, 250=0,0847, 500=0,0679, 2000=0,0583, 5000=0,0521, 20000=0,0455 (GBP); LED Colour: Red; LED Mounting: SMD; Packaging: Cut Tape; Product Range: -; Automotive Qualification Standard: -; MSL: MSL 3 - 168 hours; Current Rating: 20; Dominant Wavelength: 643; Dominant Wavelength Typ: 643; Forward Current If Max: 20; Luminous Intensity Max: 20; Luminous Intensity Typ: 17; Operating Temperature Max: 85; Operating Temperature Min: -40; Operating Temperature Range: -40°C to +85; Storage Temperature Max: +100; Storage Temperature Min: -40; ComponentLink1URL: http://www.farnell.com/cad/53023.pdf; ComponentLink1Description: http://www.farnell.com/cad/53023.pdf; ComponentLink2URL: http://www.farnell.com/datasheets/2182724.pdf; ComponentLink2Description: http://www.farnell.com/datasheets/2182724.pdf; Supplier 1: Farnell; Supplier Part Number 1: 1581239; Supplier 2: Newark; Supplier Part Number 2: 14N9358
Q1-Q3 = NX3008NBKW: NXP - NX3008NBKW - MOSFET, N CH, 30V, 350MA, SOT323; Transistor Polarity: N Channel; Continuous Drain Current Id: 350; Drain Source Voltage Vds: 30; On Resistance Rds(on): 1; Rds(on) Test Voltage Vgs: 4.5; Threshold Voltage Vgs: 900; Power Dissipation Pd: 260; Transistor Case Style: SOT-323; No. of Pins: 3; SVHC: No SVHC (17-Dec-2015); Pulse Current Idm: -0.8; Voltage Vgs th Max: 8; Manufacturer: NXP; Manufacturer Part Number: NX3008NBKW; RoHS: YES; Stock 1: 4764; Pricing 1: 1=0.0425, 25=0.0385, 100=0.0347, 250=0.0334, 500=0.0312, 2000=0.0291, 4000=0.0282, 20000=0.0273 (GBP); Operating Temperature Max: 150; Product Range: -; Automotive Qualification Standard: -; MSL: MSL 1 - Unlimited; Operating Temperature Min: -55; Operating Temperature Range: -55°C to +150; ComponentLink1URL: http://www.farnell.com/datasheets/1508392.pdf; ComponentLink1Description: http://www.farnell.com/datasheets/1508392.pdf; Supplier 1: Mouser; Supplier Part Number 1: 771-NX3008NBKW,115; Supplier 2: Farnell; Supplier Part Number 2: 2069546; Supplier 3: Arrow; Supplier Part Number 3: NX3008NBKW,115
R28 R29 = CRCW06030000Z0EA: RES SMD 0 OHM JUMPER 1/10W 0603; Manufacturer: Vishay Dale; Power (Watts): 0.1W, 1/10W; Manufacturer Part Number: CRCW06030000Z0EA; RoHS: RoHS Compliant; Category: Resistors; Stock 1: 0; Pricing 1: 1=0.1, 10=0.028, 25=0.0204, 50=0.0154, 100=0.0114, 250=0.00868, 500=0.00694, 1000=0.00511 (USD); Packaging: Cut Tape (CT); Part Status: Active; Tolerance: Jumper; Composition: Thick Film; Features: Automotive AEC-Q200; Temperature Coefficient: -; Operating Temperature: -55°C ~ 155°C; Package / Case: 0603 (1608 Metric); Supplier Device Package: 0603; Size / Dimension: 0.063" L x 0.033" W (1.60mm x 0.85mm); Height - Seated (Max): 0.020" (0.50mm); Failure Rate: -; ComponentLink1URL: http://www.vishay.com/docs/20035/dcrcwe3.pdf; ComponentLink1Description: http://www.vishay.com/docs/20035/dcrcwe3.pdf; Resistance: 0R; Supplier 1: Mouser; Supplier Part Number 1: 71-CRCW0603-0-E3; Supplier 2: Farnell; Supplier Part Number 2: 1469739; Supplier 3: Digi-Key; Supplier Part Number 3: 541-0.0GCT-ND
R30 R37 = RC0603FR-0747RL: as R1 on sheet R124_signal_conditioning; Supplier 1: Mouser; Supplier Part Number 1: 603-RC0603FR-0747RL; Manufacturer: Yageo; Manufacturer Part Number: RC0603FR-0747RL; RoHS: Yes; Category: Chip SMD Resistors; Stock 1: 314282; Pricing 1: 1=0.10000, 10=0.01800, 100=0.00600, 1000=0.00500, 5000=0.00300, 10000=0.00300 (USD); Case/Package: 0603; Number of Pins: 2; Weight: 7.1E-05oz; Case Code (Imperial): 0603; Case Code (Metric): 1608; Min Operating Temperature: -55°C; Max Operating Temperature: 155°C; Resistance: 47R; Tolerance: 1%; Packaging: Tape and Reel; Package Quantity: 1; Termination: SMD/SMT; Resistor Type: Thick Film; Number of Terminations: 2; Max Power Dissipation: 100mW; Features: Moisture Resistant; Length: 1.6mm; Height: 0.45mm; Width: 0.8mm; Depth: 0.8mm; REACH SVHC: Unknown; Lead Free: Lead Free; Military Standard: Not; ComponentLink1URL: https://datasheet.ciiva.com/2453/pyu-r-int-thick-7-2453922.pdf?src-supplier=Digi-Key; ComponentLink1Description: https://datasheet.ciiva.com/2453/pyu-r-int-thick-7-2453922.pdf?src-supplier=Digi-Key; ComponentLink2URL: https://datasheet.ciiva.com/2453/pyu-r-int-thick-7-2453923.pdf?src-supplier=Digi-Key; ComponentLink2Description: https://datasheet.ciiva.com/2453/pyu-r-int-thick-7-2453923.pdf?src-supplier=Digi-Key; ComponentLink3URL: https://datasheet.ciiva.com/2453/pyu-r-int-thick-7-2453924.pdf?src-supplier=Digi-Key; ComponentLink3Description: https://datasheet.ciiva.com/2453/pyu-r-int-thick-7-2453924.pdf?src-supplier=Digi-Key; ComponentLink4URL: https://datasheet.ciiva.com/7746/443971-7746363.pdf?src-supplier=Element14; ComponentLink4Description: https://datasheet.ciiva.com/7746/443971-7746363.pdf?src-supplier=Element14; ComponentLink5URL: https://datasheet.ciiva.com/7746/443971-7746364.pdf?src-supplier=Element14; ComponentLink5Description: https://datasheet.ciiva.com/7746/443971-7746364.pdf?src-supplier=Element14; ComponentLink6URL: https://datasheet.ciiva.com/46440/1868787-46440908.pdf?src-supplier=Element14; ComponentLink6Description: https://datasheet.ciiva.com/46440/1868787-46440908.pdf?src-supplier=Element14; Supplier 2: Farnell; Supplier Part Number 2: 9238328; Supplier 3: Digi-Key; Supplier Part Number 3: 311-47.0HRCT-ND
R31-R35 = RC0603FR-0710KL: as R2 on sheet R124_signal_conditioning; Manufacturer: YAGEO (PHYCOMP); Manufacturer Part Number: RC0603FR-0710KL; RoHS: YES; Stock 1: 9995; Pricing 1: 5000=0.0025, 25000=0.0014, 50000=0.0013 (GBP); Resistance: 10k; Resistance Tolerance: ± 1%; Packaging: Tape & Reel; Resistor Element Material: Thick Film; Automotive Qualification Standard: -; MSL: MSL 1 - Unlimited<!--FANDB--><div class="features-and-benefits-container"><div class="features-and-benefits-desc-container"><span class="features-and-benefits-container-desc">SMD Chip Resistor, Thick Film, 10 kohm, 50 V, 0603 [1608 Metric], 100 mW, ± 1; ComponentLink1URL: http://past.yageo.com/pdf/PYu-R_Packing_6.pdf; ComponentLink1Description: http://past.yageo.com/pdf/PYu-R_Packing_6.pdf; ComponentLink2URL: http://www.farnell.com/datasheets/2167052.pdf; ComponentLink2Description: http://www.farnell.com/datasheets/2167052.pdf; Supplier 1: Mouser; Supplier Part Number 1: 603-RC0603FR-0710KL; Supplier 2: Farnell; Supplier Part Number 2: 2421850; Supplier 3: Digi-Key; Supplier Part Number 3: 311-10.0KHRCT-ND
R36 = MCWR06X1001FTL: as R7 on sheet R124_signal_conditioning; Manufacturer: MULTICOMP; Manufacturer Part Number: MCWR06X1001FTL; RoHS: Y-EX; Stock 1: 134740; Pricing 1: 10=0.0037, 100=0.0022, 500=0.0016, 1000=0.0012, 2500=0.001 (GBP); Resistance: 1k; Resistance Tolerance: ± 1%; Packaging: Cut Tape; Resistor Element Material: Thick Film; Automotive Qualification Standard: -; ComponentLink1URL: http://www.farnell.com/datasheets/1849611.pdf; ComponentLink1Description: http://www.farnell.com/datasheets/1849611.pdf; Supplier 1: Farnell; Supplier Part Number 1: 2447272; Supplier 2: Newark; Supplier Part Number 2: 94X1378
SW1 = KMR241G LFS: C & K COMPONENTS - KMR241G LFS - SWITCH, SMD, 4N, 0.05A, 32VDC, SPST-NO; Illumination: Non Illuminated; Contact Voltage DC Nom: 32; Contact Current Max: 50; Operating Force: 4; Switch Terminals: Solder; SVHC: No SVHC (17-Dec-2015); Actuation Type: Top; Actuator / Cap Colour: Black; Contact Resistance: 100; External Depth: 2.8; External Length / Height: 1.9; External Width: 4.6; Power Rating: 1VA<!--FANDB--><div class="features-and-benefits-container"><div class="features-and-benefits-description"><span class="features-benefits-value">The KMR241G LFS is a micro-miniature SMD Tactile Switch with momentary action and SPST-NO contact arrangement. It has silver-plated gull-wing terminals and grounding pin.</span></div><div class="features-and-benefits-list"><ul class="features-and-benefits-list-list"><li class="features-and-benefits-list-item">Top actuated</li><li class="features-and-benefits-list-item">Excellent tactile feel</li><li class="features-and-benefits-list-item">Ultra low current capabilities</li><li class="features-and-benefits-list-item">300000-cycle Operating life</li><li class="features-and-benefits-list-item">IP40 Protection rating</li></ul></div><div class="features-and-benefits-applications"><ul class="features-and-benefits-value"><li class="features-and-benefits-list-item">Automotive</li><li class="features-and-benefits-list-item">Industrial</li><li class="features-and-benefits-list-item">Medical</li><li class="features-and-benefits-list-item">Portable Devices</li></ul></div></div>; Manufacturer: C & K COMPONENTS; Manufacturer Part Number: KMR241G LFS; RoHS: YES; Stock 1: 40256; Pricing 1: 1=0.384, 50=0.37, 100=0.218, 7000=0.185, 20000=0.181, 30000=0.178, 50000=0.174 (GBP); Product Range: -; Contact Configuration: SPST-NO; Operating Temperature Max: 85; Operating Temperature Min: -40; ComponentLink1URL: http://www.farnell.com/datasheets/1702857.pdf; ComponentLink1Description: http://www.farnell.com/datasheets/1702857.pdf; Supplier 1: Mouser; Supplier Part Number 1: 611-KMR241GLFS; Supplier 2: Farnell; Supplier Part Number 2: 1437637; Supplier 3: Digi-Key; Supplier Part Number 3: CKN10248DKR-ND
U4 = SA818S-U: 1W Embedded small size walkie talkie module